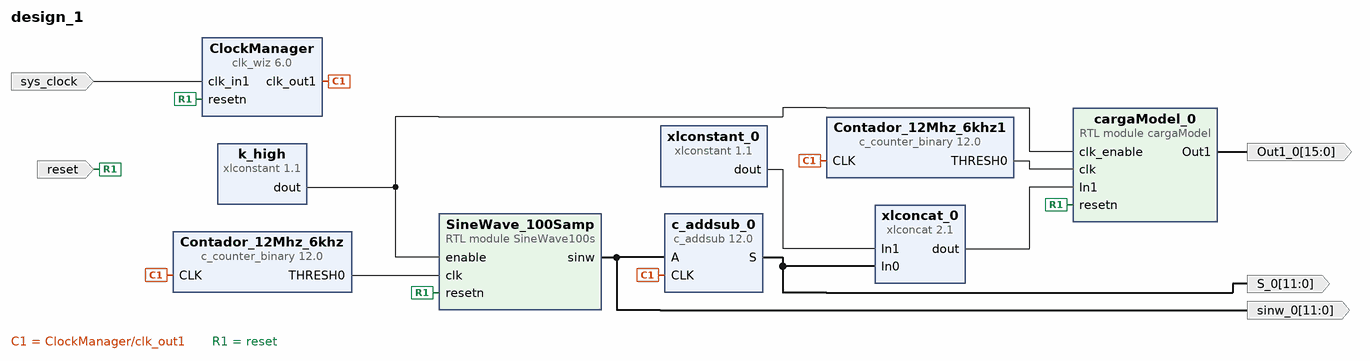
[diagram p0: block diagram of the top level]
# Vivado block design design_1, xc7a35ticsg324-1L, Vivado 2018.2
create_bd_design design_1

create_bd_port -dir I -type clk sys_clock
set_property -dict {CONFIG.FREQ_HZ 100000000 CONFIG.PHASE 0.000} [get_bd_ports sys_clock]
create_bd_port -dir I -type rst reset
set_property -dict {CONFIG.POLARITY ACTIVE_LOW} [get_bd_ports reset]
create_bd_port -dir O -from 15 -to 0 Out1_0
create_bd_port -dir O -from 11 -to 0 sinw_0
create_bd_port -dir O -from 11 -to 0 -type data S_0

create_bd_cell -type ip -vlnv xilinx.com:ip:clk_wiz:6.0 ClockManager
set_property -dict [list \
  CONFIG.PRIMITIVE PLL \
  CONFIG.CLKOUT1_REQUESTED_OUT_FREQ 12 \
  CONFIG.CLKOUT1_DRIVES BUFGCE \
  CONFIG.CLKOUT2_DRIVES BUFGCE \
  CONFIG.CLKOUT3_DRIVES BUFGCE \
  CONFIG.CLKOUT4_DRIVES BUFGCE \
  CONFIG.CLKOUT5_DRIVES BUFGCE \
  CONFIG.CLKOUT6_DRIVES BUFGCE \
  CONFIG.CLKOUT7_DRIVES BUFGCE \
  CONFIG.FEEDBACK_SOURCE FDBK_AUTO \
  CONFIG.USE_LOCKED false \
  CONFIG.RESET_PORT resetn \
  CONFIG.MMCM_DIVCLK_DIVIDE 5 \
  CONFIG.MMCM_CLKFBOUT_MULT_F 42 \
  CONFIG.MMCM_COMPENSATION ZHOLD \
  CONFIG.MMCM_CLKOUT0_DIVIDE_F 70 \
  CONFIG.RESET_TYPE ACTIVE_LOW \
  CONFIG.USE_SAFE_CLOCK_STARTUP true \
  CONFIG.USE_BOARD_FLOW true \
  CONFIG.CLK_IN1_BOARD_INTERFACE sys_clock \
  CONFIG.RESET_BOARD_INTERFACE reset \
  CONFIG.CLKOUT1_JITTER 421.067 \
  CONFIG.CLKOUT1_PHASE_ERROR 310.955 \
] [get_bd_cells ClockManager]
create_bd_cell -type ip -vlnv xilinx.com:ip:c_counter_binary:12.0 Contador_12Mhz_6khz
set_property -dict [list \
  CONFIG.Output_Width 11 \
  CONFIG.Restrict_Count true \
  CONFIG.Final_Count_Value 7D0 \
  CONFIG.Sync_Threshold_Output true \
  CONFIG.Threshold_Value 7D0 \
  CONFIG.SCLR false \
] [get_bd_cells Contador_12Mhz_6khz]
create_bd_cell -type ip -vlnv xilinx.com:ip:xlconstant:1.1 k_high
create_bd_cell -type ip -vlnv xilinx.com:ip:c_addsub:12.0 c_addsub_0
set_property -dict [list \
  CONFIG.A_Type Signed \
  CONFIG.B_Type Unsigned \
  CONFIG.A_Width 12 \
  CONFIG.B_Width 12 \
  CONFIG.Add_Mode Subtract \
  CONFIG.Out_Width 12 \
  CONFIG.Latency 1 \
  CONFIG.B_Constant true \
  CONFIG.B_Value 100000000000 \
  CONFIG.CE false \
] [get_bd_cells c_addsub_0]
create_bd_cell -type ip -vlnv xilinx.com:ip:c_counter_binary:12.0 Contador_12Mhz_6khz1
set_property -dict [list \
  CONFIG.Output_Width 14 \
  CONFIG.Restrict_Count true \
  CONFIG.Final_Count_Value 2710 \
  CONFIG.Sync_Threshold_Output true \
  CONFIG.Threshold_Value 2710 \
  CONFIG.SCLR false \
] [get_bd_cells Contador_12Mhz_6khz1]
create_bd_cell -type ip -vlnv xilinx.com:ip:xlconcat:2.1 xlconcat_0
set_property -dict {CONFIG.IN0_WIDTH 12 CONFIG.IN1_WIDTH 4} [get_bd_cells xlconcat_0]
create_bd_cell -type ip -vlnv xilinx.com:ip:xlconstant:1.1 xlconstant_0
set_property -dict {CONFIG.CONST_WIDTH 4 CONFIG.CONST_VAL 0000} [get_bd_cells xlconstant_0]
create_bd_cell -type module -reference SineWave100s SineWave_100Samp
create_bd_cell -type module -reference cargaModel cargaModel_0

# ---- connections ----

connect_bd_net -net clk_wiz_0_clk_out1 [get_bd_pins ClockManager/clk_out1] \
  [get_bd_pins Contador_12Mhz_6khz/CLK] [get_bd_pins c_addsub_0/CLK] [get_bd_pins Contador_12Mhz_6khz1/CLK]
connect_bd_net -net xlconstant_0_dout [get_bd_pins k_high/dout] [get_bd_pins SineWave_100Samp/enable] [get_bd_pins cargaModel_0/clk_enable]
connect_bd_net [get_bd_pins xlconstant_0/dout] [get_bd_pins xlconcat_0/In1]
connect_bd_net [get_bd_pins xlconcat_0/dout] [get_bd_pins cargaModel_0/In1]
connect_bd_net [get_bd_pins cargaModel_0/Out1] [get_bd_ports Out1_0]
connect_bd_net [get_bd_pins Contador_12Mhz_6khz1/THRESH0] [get_bd_pins cargaModel_0/clk]
connect_bd_net -net proc_sys_reset_0_interconnect_aresetn [get_bd_ports reset] \
  [get_bd_pins cargaModel_0/resetn] [get_bd_pins SineWave_100Samp/resetn] [get_bd_pins ClockManager/resetn]
connect_bd_net [get_bd_pins SineWave_100Samp/sinw] [get_bd_pins c_addsub_0/A] [get_bd_ports sinw_0]
connect_bd_net [get_bd_pins Contador_12Mhz_6khz/THRESH0] [get_bd_pins SineWave_100Samp/clk]
connect_bd_net [get_bd_ports sys_clock] [get_bd_pins ClockManager/clk_in1]
connect_bd_net [get_bd_pins c_addsub_0/S] [get_bd_ports S_0] [get_bd_pins xlconcat_0/In0]

validate_bd_design
save_bd_design
